# EAGLE design interrupter-reva (EAGLE 9.6.2)
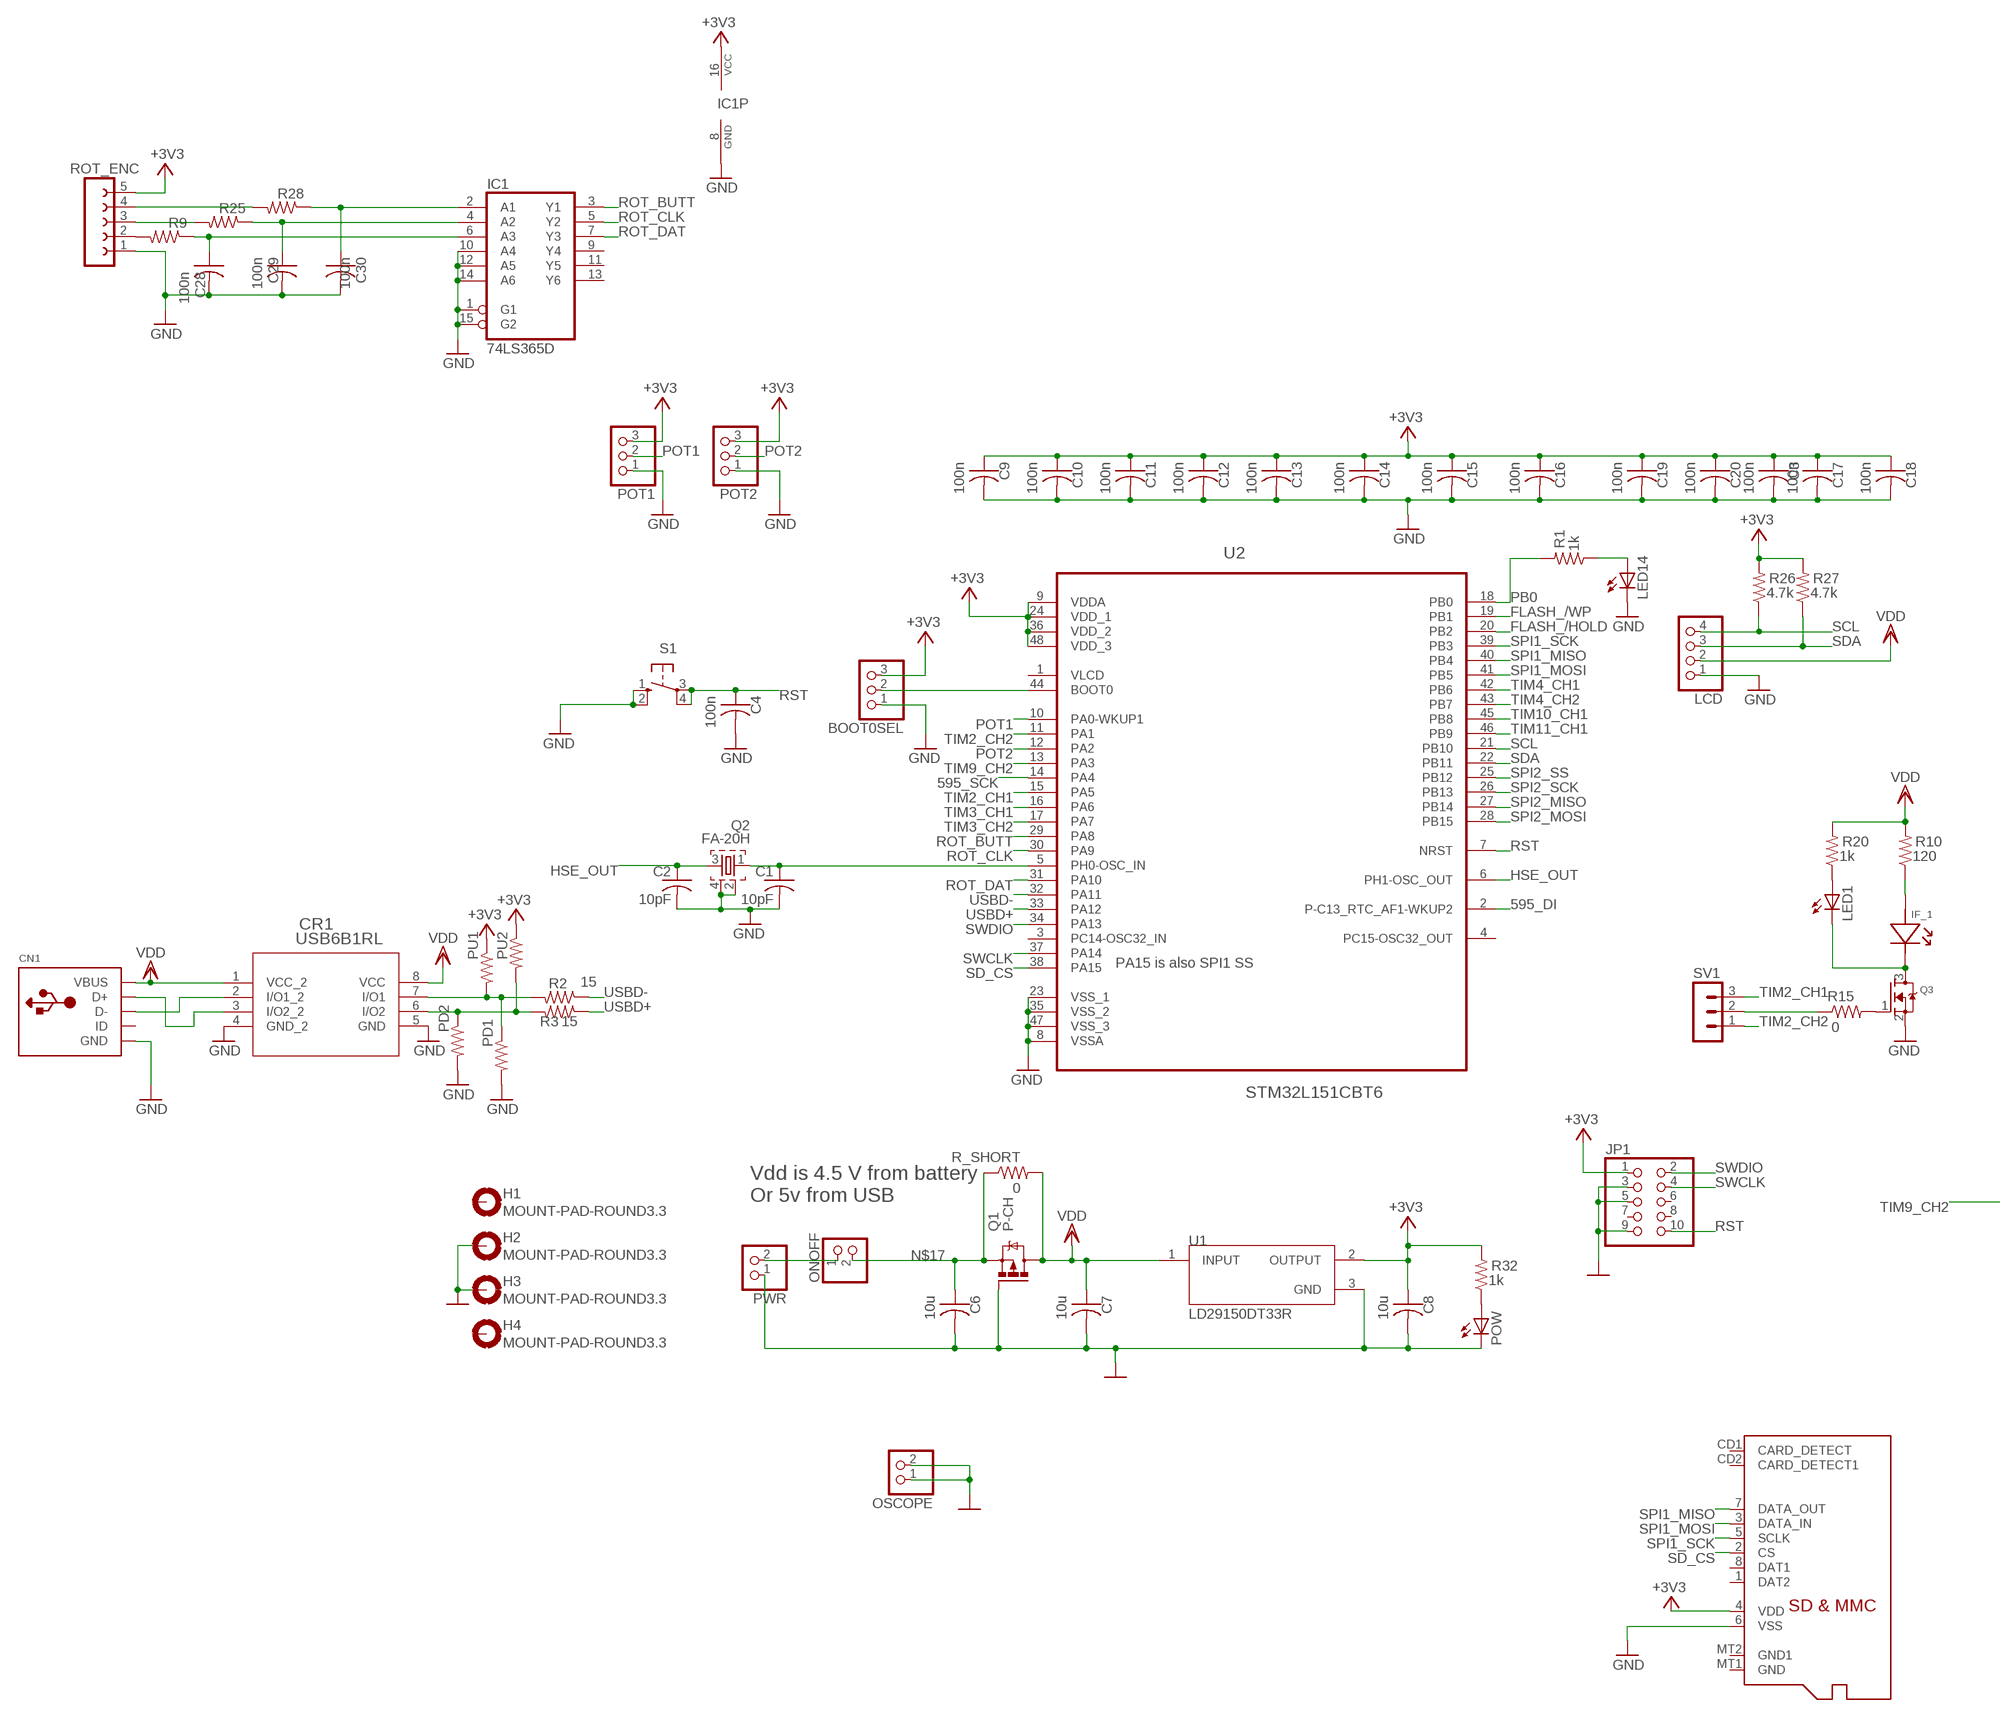
[diagram p0: schematic, sheet 1, part 1 of 2]
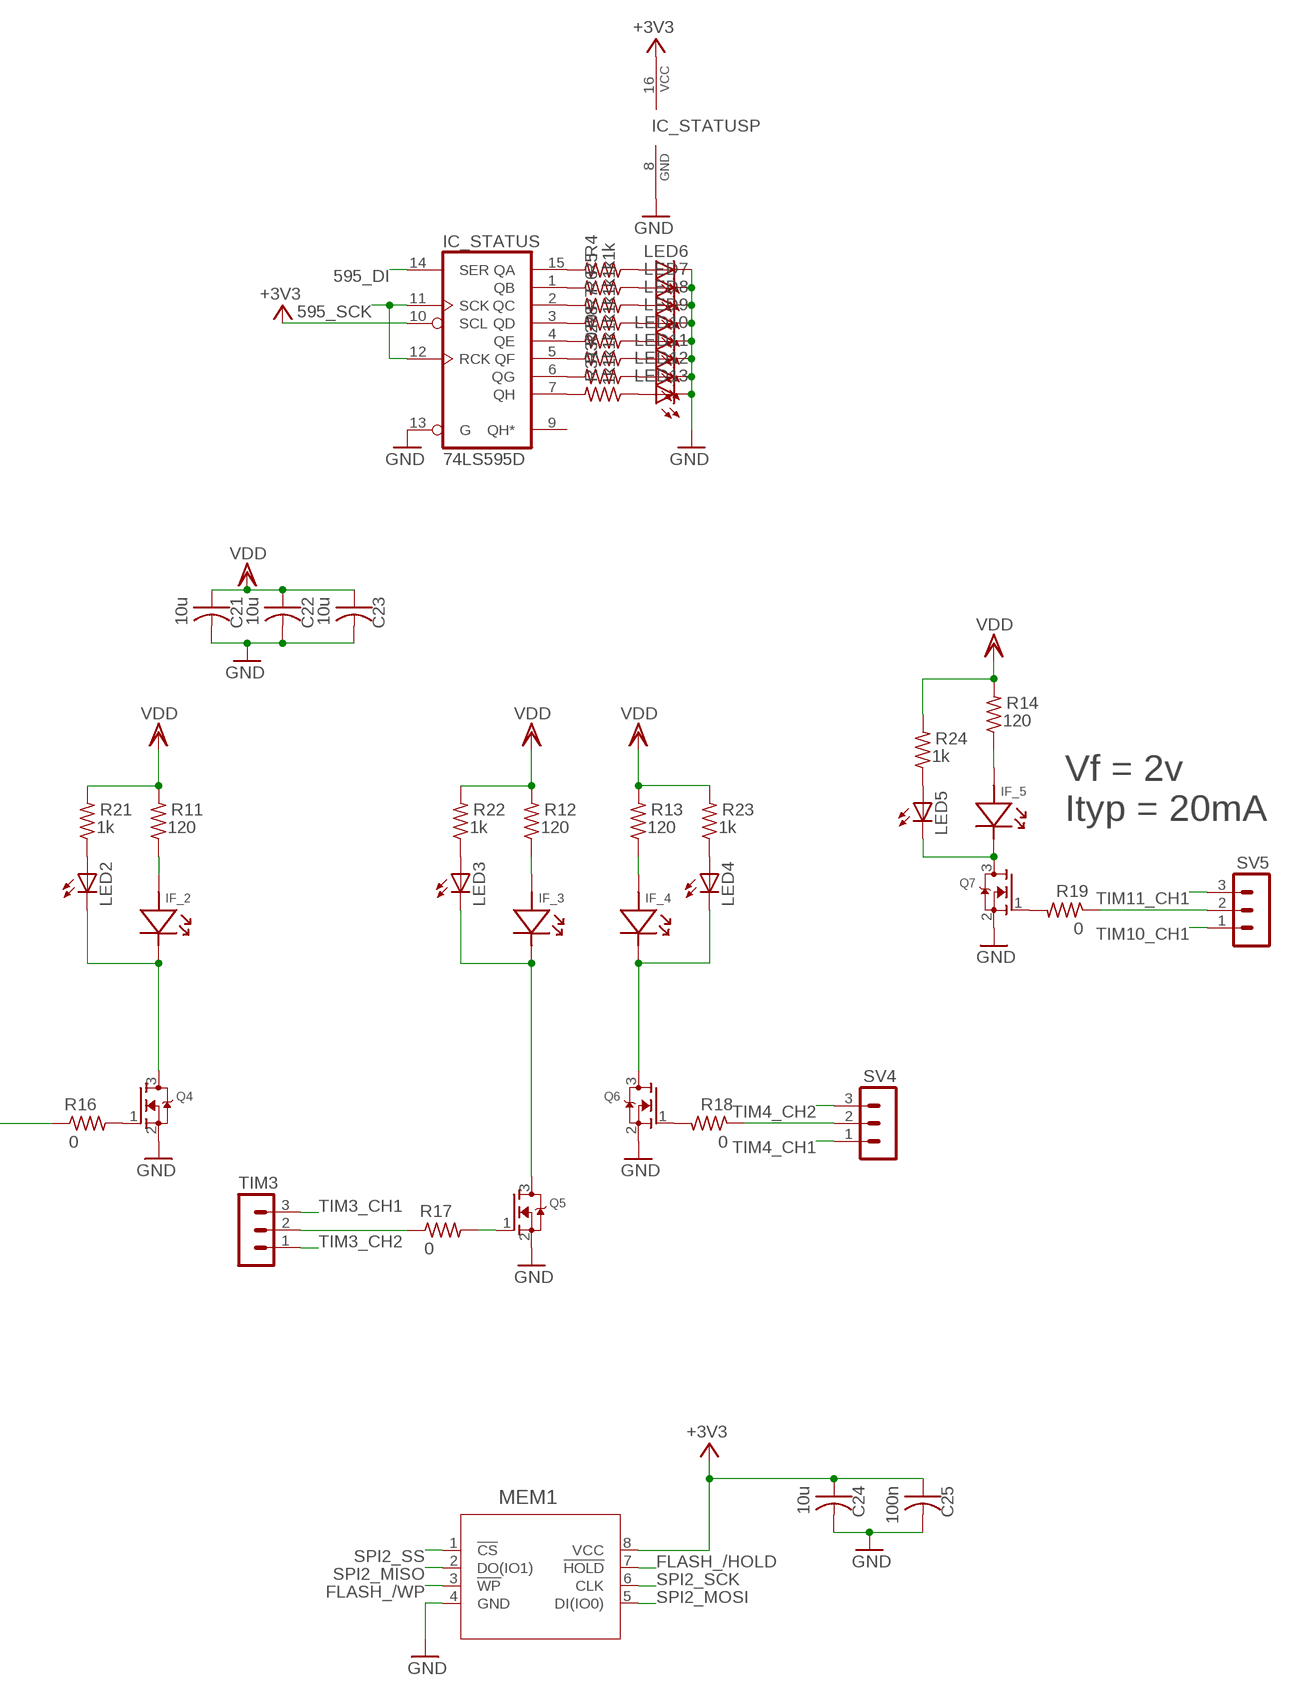
[diagram p1: schematic, sheet 1, part 2 of 2]

## Parts
BOOT0SEL  PINHD-1X3  [1X03]
C1  10pF  C-USC0603  [C0603]
C2  10pF  C-USC0603  [C0603]
C3  100n  C-USC0805  [C0805]
C4  100n  C-USC0402  [C0402]
C6  10u  C-USC0805  [C0805]
C7  10u  C-USC0805  [C0805]
C8  10u  C-USC0603  [C0603]
C9  100n  C-USC0805  [C0805]
C10  100n  C-USC0603  [C0603]
C11  100n  C-USC0805  [C0805]
C12  100n  C-USC0603  [C0603]
C13  100n  C-USC0805  [C0805]
C14  100n  C-USC0603  [C0603]
C15  100n  C-USC0805  [C0805]
C16  100n  C-USC0603  [C0603]
C17  100n  C-USC0805  [C0805]
C18  100n  C-USC0603  [C0603]
C19  100n  C-USC0603  [C0603]
C20  100n  C-USC0805  [C0805]
C21  10u  C-USC0805  [C0805]
C22  10u  C-USC0805  [C0805]
C23  10u  C-USC0805  [C0805]
C24  10u  C-USC0603  [C0603]
C25  100n  C-USC0805  [C0805]
C28  100n  C-USC0603  [C0603]
C29  100n  C-USC0603  [C0603]
C30  100n  C-USC0603  [C0603]
CN1  USBMINIB  [USB-MINIB]
CR1  USB6B1RL  [SO-8_STM]
H1  MOUNT-PAD-ROUND3.3  [3,3-PAD]
H2  MOUNT-PAD-ROUND3.3  [3,3-PAD]
H3  MOUNT-PAD-ROUND3.3  [3,3-PAD]
H4  MOUNT-PAD-ROUND3.3  [3,3-PAD]
IC1  74LS365D  [SO16]
IC_STATUS  74LS595D  [SO16]
IF_1  IF-E96E  [IF-E96E]
IF_2  IF-E96E  [IF-E96E]
IF_3  IF-E96E  [IF-E96E]
IF_4  IF-E96E  [IF-E96E]
IF_5  IF-E96E  [IF-E96E]
JP1  PINHD-2X5  [2X05]
LCD  PINHD-1X4  [1X04]
LED1  LEDCHIP-LED0805  [CHIP-LED0805]
LED2  LEDCHIP-LED0805  [CHIP-LED0805]
LED3  LEDCHIP-LED0805  [CHIP-LED0805]
LED4  LEDCHIP-LED0805  [CHIP-LED0805]
LED5  LEDCHIP-LED0805  [CHIP-LED0805]
LED6  LEDCHIP-LED0805  [CHIP-LED0805]
LED7  LEDCHIP-LED0805  [CHIP-LED0805]
LED8  LEDCHIP-LED0805  [CHIP-LED0805]
LED9  LEDCHIP-LED0805  [CHIP-LED0805]
LED10  LEDCHIP-LED0805  [CHIP-LED0805]
LED11  LEDCHIP-LED0805  [CHIP-LED0805]
LED12  LEDCHIP-LED0805  [CHIP-LED0805]
LED13  LEDCHIP-LED0805  [CHIP-LED0805]
LED14  LEDCHIP-LED0805  [CHIP-LED0805]
MEM1  W25X40CLSNIG  [WIN_SN-8_WIN]
ONOFF  PINHD-1X2  [1X02]
OSCOPE  PINHD-1X2  [1X02]
PD1  15  R-US_R0603  [R0603]
PD2  15  R-US_R0603  [R0603]
POT1  PINHD-1X3  [1X03]
POT2  PINHD-1X3  [1X03]
POW  LEDCHIP-LED0805  [CHIP-LED0805]
PU1  15  R-US_R0603  [R0603]
PU2  15  R-US_R0603  [R0603]
PWR  PINHD-1X2  [1X02]
Q1  P-CH  IRLML5203  [MICRO3]
Q2  FA-20H  [FA-20H]
Q3  MOSFET-NREFLOW  [SOT23]
Q4  MOSFET-NREFLOW  [SOT23]
Q5  MOSFET-NREFLOW  [SOT23]
Q6  MOSFET-NREFLOW  [SOT23]
Q7  MOSFET-NREFLOW  [SOT23]
R1  1k  R-US_R0603  [R0603]
R2  15  R-US_R0603  [R0603]
R3  15  R-US_R0603  [R0603]
R4  1k  R-US_R0603  [R0603]
R5  1k  R-US_R0603  [R0603]
R6  1k  R-US_R0603  [R0603]
R7  1k  R-US_R0603  [R0603]
R8  1k  R-US_R0603  [R0603]
R9  R-US_R0603  [R0603]
R10  120  R-US_R0805  [R0805]
R11  120  R-US_R0805  [R0805]
R12  120  R-US_R0805  [R0805]
R13  120  R-US_R0805  [R0805]
R14  120  R-US_R0805  [R0805]
R15  0  R-US_R0805  [R0805]
R16  0  R-US_R0805  [R0805]
R17  0  R-US_R0805  [R0805]
R18  0  R-US_R0805  [R0805]
R19  0  R-US_R0805  [R0805]
R20  1k  R-US_R0805  [R0805]
R21  1k  R-US_R0805  [R0805]
R22  1k  R-US_R0805  [R0805]
R23  1k  R-US_R0805  [R0805]
R24  1k  R-US_R0805  [R0805]
R25  R-US_R0603  [R0603]
R26  4.7k  R-US_R0805  [R0805]
R27  4.7k  R-US_R0805  [R0805]
R28  R-US_R0603  [R0603]
R29  1k  R-US_R0603  [R0603]
R30  1k  R-US_R0603  [R0603]
R31  1k  R-US_R0603  [R0603]
R32  1k  R-US_R0603  [R0603]
R_SHORT  0  R-US_R0805  [R0805]
ROT_ENC  FE05-1  [FE05-1]
S1  10-XX  [B3F-10XX]
SV1  MA03-1  [MA03-1]
SV4  MA03-1  [MA03-1]
SV5  MA03-1  [MA03-1]
TIM3  MA03-1  [MA03-1]
U1  LD29150DT33R  [DPAK456P972X240-3N]
U2  STM32L151CBT6  [QFP50P900X900X160-48N]
U$1  MICROSD  [MICROSD]

## Nets
595_DI: IC_STATUS.14(SER) U2.2(P-C13_RTC_AF1-WKUP2)
595_SCK: IC_STATUS.11(SCK) IC_STATUS.12(RCK) U2.14(PA4)
+3V3: BOOT0SEL.3 C3.1 C8.1 C9.1 C10.1 C11.1 C12.1 C13.1 C14.1 C15.1 C16.1 C17.1 C18.1 C19.1 C20.1 C24.1 C25.1 IC1.16(VCC) IC_STATUS.10(SCL) IC_STATUS.16(VCC) JP1.1 MEM1.8(VCC) POT1.3 POT2.3 PU1.1 PU2.1 R26.2 R27.2 R32.2 ROT_ENC.5 U1.2(OUTPUT) U2.9(VDDA) U2.24(VDD_1) U2.36(VDD_2) U2.48(VDD_3) U$1.4(VDD)
FLASH_/HOLD: MEM1.7(!HOLD) U2.20(PB2)
FLASH_/WP: MEM1.3(!WP) U2.19(PB1)
GND: BOOT0SEL.1 C1.2 C2.2 C3.2 C4.2 C6.2 C7.2 C8.2 C9.2 C10.2 C11.2 C12.2 C13.2 C14.2 C15.2 C16.2 C17.2 C18.2 C19.2 C20.2 C21.2 C22.2 C23.2 C24.2 C25.2 C28.2 C29.2 C30.2 CN1.GND CR1.4(GND_2) CR1.5(GND) H2.B3,3(MOUNT) H3.B3,3(MOUNT) IC1.1(G1) IC1.8(GND) IC1.10(A4) IC1.12(A5) IC1.14(A6) IC1.15(G2) IC_STATUS.8(GND) IC_STATUS.13(G) JP1.3 JP1.5 JP1.9 LCD.1 LED6.C LED7.C LED8.C LED9.C LED10.C LED11.C LED12.C LED13.C LED14.C MEM1.4(GND) OSCOPE.1 OSCOPE.2 PD1.2 PD2.2 POT1.1 POT2.1 POW.C PWR.1 Q1.1(G) Q2.2 Q2.4 Q3.2(S) Q4.2(S) Q5.2(S) Q6.2(S) Q7.2(S) ROT_ENC.1 S1.1(S) S1.2(S1) U1.3(GND) U2.8(VSSA) U2.23(VSS_1) U2.35(VSS_2) U2.47(VSS_3) U$1.6(VSS)
HSE_OUT: C2.1 Q2.3 U2.6(PH1-OSC_OUT)
N$1: R9.2 ROT_ENC.2
N$2: LED1.A R20.1
N$3: CN1.D- CR1.2(I/O1_2)
N$4: LED2.A R21.1
N$5: LED3.A R22.1
N$6: LED5.A R24.1
N$7: IF_1.ANODE R10.1
N$8: IF_2.ANODE R11.1
N$9: IF_3.ANODE R12.1
N$10: IF_4.ANODE R13.1
N$11: IF_5.ANODE R14.1
N$12: IF_1.CATHODE LED1.C Q3.3(D)
N$13: IF_2.CATHODE LED2.C Q4.3(D)
N$14: IF_3.CATHODE LED3.C Q5.3(D)
N$15: IF_4.CATHODE LED4.C Q6.3(D)
N$16: IF_5.CATHODE LED5.C Q7.3(D)
N$17: C6.1 ONOFF.2 Q1.2(S) R_SHORT.1
N$18: ONOFF.1 PWR.2
N$19: CN1.D+ CR1.3(I/O2_2)
N$20: CR1.7(I/O1) PD1.1 PU1.2 R2.2
N$21: R25.2 ROT_ENC.3
N$22: Q7.1(G) R19.2
N$23: R28.2 ROT_ENC.4
N$24: CR1.6(I/O2) PD2.1 PU2.2 R3.2
N$25: LED4.A R23.1
N$26: C28.1 IC1.6(A3) R9.1
N$27: C29.1 IC1.4(A2) R25.1
N$28: C30.1 IC1.2(A1) R28.1
N$29: LED6.A R4.1
N$30: IC_STATUS.15(QA) R4.2
N$31: C1.1 Q2.1 U2.5(PH0-OSC_IN)
N$32: LED7.A R5.1
N$33: IC_STATUS.1(QB) R5.2
N$34: LED8.A R6.1
N$35: IC_STATUS.2(QC) R6.2
N$36: LED9.A R7.1
N$37: IC_STATUS.3(QD) R7.2
N$38: LED10.A R8.1
N$39: IC_STATUS.4(QE) R8.2
N$40: LED11.A R29.1
N$41: IC_STATUS.5(QF) R29.2
N$42: LED12.A R30.1
N$43: IC_STATUS.6(QG) R30.2
N$44: BOOT0SEL.2 U2.44(BOOT0)
N$45: R15.1 SV1.2
N$46: Q3.1(G) R15.2
N$47: Q4.1(G) R16.2
N$48: LED13.A R31.1
N$49: Q5.1(G) R17.2
N$50: R17.1 TIM3.2
N$51: Q6.1(G) R18.2
N$52: R18.1 SV4.2
N$53: R19.1 SV5.2
N$54: IC_STATUS.7(QH) R31.2
N$55: LED14.A R1.1
N$56: POW.A R32.1
PB0: R1.2 U2.18(PB0)
POT1: POT1.2 U2.10(PA0-WKUP1)
POT2: POT2.2 U2.12(PA2)
ROT_BUTT: IC1.3(Y1) U2.29(PA8)
ROT_CLK: IC1.5(Y2) U2.30(PA9)
ROT_DAT: IC1.7(Y3) U2.31(PA10)
RST: C4.1 JP1.10 S1.3(P) S1.4(P1) U2.7(NRST)
SCL: LCD.4 R26.1 U2.21(PB10)
SD_CS: U2.38(PA15) U$1.2(CS)
SDA: LCD.3 R27.1 U2.22(PB11)
SPI1_MISO: U2.40(PB4) U$1.7(DATA_OUT)
SPI1_MOSI: U2.41(PB5) U$1.3(DATA_IN)
SPI1_SCK: U2.39(PB3) U$1.5(SCLK)
SPI2_MISO: MEM1.2(DO(IO1)) U2.27(PB14)
SPI2_MOSI: MEM1.5(DI(IO0)) U2.28(PB15)
SPI2_SCK: MEM1.6(CLK) U2.26(PB13)
SPI2_SS: MEM1.1(!CS) U2.25(PB12)
SWCLK: JP1.4 U2.37(PA14)
SWDIO: JP1.2 U2.34(PA13)
TIM2_CH1: SV1.3 U2.15(PA5)
TIM2_CH2: SV1.1 U2.11(PA1)
TIM3_CH1: TIM3.3 U2.16(PA6)
TIM3_CH2: TIM3.1 U2.17(PA7)
TIM4_CH1: SV4.1 U2.42(PB6)
TIM4_CH2: SV4.3 U2.43(PB7)
TIM9_CH2: R16.1 U2.13(PA3)
TIM10_CH1: SV5.1 U2.45(PB8)
TIM11_CH1: SV5.3 U2.46(PB9)
USBD+: R3.1 U2.33(PA12)
USBD-: R2.1 U2.32(PA11)
VDD: C7.1 C21.1 C22.1 C23.1 CN1.VBUS CR1.1(VCC_2) CR1.8(VCC) LCD.2 Q1.3(D) R10.2 R11.2 R12.2 R13.2 R14.2 R20.2 R21.2 R22.2 R23.2 R24.2 R_SHORT.2 U1.1(INPUT)
Unconnected: CN1.ID H1.B3,3(MOUNT) H4.B3,3(MOUNT) IC1.9(Y4) IC1.11(Y5) IC1.13(Y6) IC_STATUS.9(QH*) JP1.6 JP1.7 JP1.8 U2.3(PC14-OSC32_IN) U2.4(PC15-OSC32_OUT) U$1.1(DAT2) U$1.8(DAT1) U$1.CD1(CARD_DETECT) U$1.CD2(CARD_DETECT1) U$1.MT1(GND) U$1.MT2(GND1)

## Notes on the sheet
- Vf = 2v
  Ityp = 20mA
- PA15 is also SPI1 SS
- Vdd is 4.5 V from battery
  Or 5v from USB

## Power pins joined to a net without a drawn wire
VLCD: U2.1(VLCD)

## Library data of the parts
BOOT0SEL POT1 POT2 = pinhead:PINHD-1X3: PIN HEADER
C1-C4 C6-C25 C28-C30 = rcl:C-US: CAPACITOR, American symbol; SPICEPREFIX: C
CN1 = adafruit:USB: USB Connectors USBMINIB - Surface Mount Female Mini-B USB Connector 4UConnector: 06564 By microbuilder.eu Thru-hole RA Female Mini-B USB Connector 4UConnector: 18732 By ladyada.net
CR1 = USB_ESD:USB6B1RL; COPYRIGHT: Copyright (C) 2022 Ultra Librarian. All rights reserved.; DIGI-KEY_PART_NUMBER_1: 497-3281-1-ND; DIGI-KEY_PART_NUMBER_2: 497-3281-2-ND; DIGI-KEY_PART_NUMBER_3: 497-3281-6-ND; MANUFACTURER_PART_NUMBER: USB6B1RL; MFR_NAME: STMicroelectronics
H1-H4 = holes:MOUNT-PAD-ROUND: MOUNTING PAD, round
IC1 = 74xx-us:74*365: Hex BUS DRIVER, 3-state
IC_STATUS = 74xx-us:74*595: 8-bit SHIFT REGISTER, output latch
IF_1-IF_5 = IF-E96E:IF-E96E
JP1 = pinhead:PINHD-2X5: PIN HEADER
LCD = pinhead:PINHD-1X4: PIN HEADER
LED1-LED14 POW = adafruit:LED: LED OSRAM: - CHIPLED LG R971, LG N971, LY N971, LG Q971, LY Q971, LO R971, LY R971 LH N974, LH R974 LS Q976, LO Q976, LY Q976 LO Q996 - Hyper CHIPLED LW Q18S LB Q993, LB Q99A, LB R99A - SideLED LS A670, LO A670, LY A670, LG A670, LP A670 LB A673, LV A673, LT A673, LW A673 LH A674 LY A675 LS A676, LA A676, LO A676, LY A676, LW A676 LS A679, LY A679, LG A679 - Hyper Micro SIDELED® LS Y876, LA Y876, LO Y876, LY Y876 LT Y87S - SmartLED LW L88C, LW L88S LB L89C, LB L89S, LG L890 LS L89K, LO L89K, LY L89K LS L896, LA L896, LO L896, LY L896 - TOPLED LS T670, LO T670, LY T670, LG T670, LP T670 LSG T670, LSP T670, LSY T670, LOP T670, LYG T670 LG T671, LOG T671, LSG T671 LB T673, LV T673, LT T673, LW T673 LH T674 LS T676, LA T676, LO T676, LY T676, LB T676, LH T676, LSB T676, LW T676 LB T67C, LV T67C, LT T67C, LS T67K, LO T67K, LY T67K, LW E67C LS E67B, LA E67B, LO E67B, LY E67B, LB E67C, LV E67C, LT E67C LW T67C LS T679, LY T679, LG T679 LS T770, LO T770, LY T770, LG T770, LP T770 LB T773, LV T773, LT T773, LW T773 LH T774 LS E675, LA E675, LY E675, LS T675 LS T776, LA T776, LO T776, LY T776, LB T776 LHGB T686 LT T68C, LB T68C - Hyper Mini TOPLED® LB M676 - Mini TOPLED Santana® LG M470 LS M47K, LO M47K, LY M47K Source: http://www.osram.convergy.de/
MEM1 = W25X40CL:W25X40CLSNIG; COPYRIGHT: Copyright (C) 2022 Ultra Librarian. All rights reserved.; DIGI-KEY_PART_NUMBER_1: W25X40CLSNIG-CRL-ND; DIGI-KEY_PART_NUMBER_2: W25X40CLSNIG-ND; DIGI-KEY_PART_NUMBER_3: WICC-1015-ND; DIGI-KEY_PART_NUMBER_4: WICC-1023-ND; DIGI-KEY_PART_NUMBER_5: WICC-1025-ND; DIGI-KEY_PART_NUMBER_6: WICC-1026-ND; MANUFACTURER_PART_NUMBER: W25X40CLSNIG; MFR_NAME: Winbond
ONOFF OSCOPE PWR = pinhead:PINHD-1X2: PIN HEADER
PD1 PD2 PU1 PU2 R1-R32 R_SHORT = rcl:R-US_: RESISTOR, American symbol; SPICEPREFIX: R
Q1 = transistor-power:IRLML5203: HEXFET P-Channel Power MOSFET
Q2 = crystal:FA-: MHz RANGE CRYSTAL UNIT Source: Epson Toyocom
Q3-Q7 = adafruit:MOSFET-N: N-Channel Mosfet 2N7002E - 60V 260mA SOT23 [Digikey: 2N7002ET1GOSTR-ND] - REEL BSH103 - 30V 850mA SOT23 [Digikey: 568-5013-1-ND]
ROT_ENC = con-lsta:FE05-1: FEMALE HEADER; OC_FARNELL: unknown; OC_NEWARK: unknown
S1 = switch-omron:10-XX: OMRON SWITCH; MPN: B3F-1000; OC_FARNELL: 176432; OC_NEWARK: 36M3542
SV1 SV4 SV5 TIM3 = con-lstb:MA03-1: PIN HEADER; OC_FARNELL: unknown; OC_NEWARK: unknown
U1 = LD29150DT33R:LD29150DT33R: LD29150 Series 1.5 A 3.3 V Fixed Output SMT LDO Voltage Regulator - TO-252 Check availability <https://pricing.snapeda.com/parts/LD29150DT33R/STMicroelectronics/view-part?ref=eda>; AVAILABILITY: In Stock; DESCRIPTION: Linear Voltage Regulator IC Positive Fixed 1 Output 1.5A DPAK; MF: STMicroelectronics; MP: LD29150DT33R; PACKAGE: TO-252 STMicroelectronics; PRICE: None; PURCHASE-URL: https://pricing.snapeda.com/search/part/LD29150DT33R/?ref=eda
U2 = STM32L151CBT6:STM32L151CBT6: ARM-based 32-bit MCU Check availability <https://pricing.snapeda.com/parts/STM32L151CBT6/STMicroelectronics/view-part?ref=eda>; AVAILABILITY: In Stock; DESCRIPTION: ARM® Cortex®-M3 series Microcontroller IC 32-Bit Single-Core 32MHz 128KB (128K x 8) FLASH 48-LQFP (7x7); MF: STMicroelectronics; MP: STM32L151CBT6; PACKAGE: LQFP-48 STMicroelectronics; PRICE: None; PURCHASE-URL: https://pricing.snapeda.com/search/part/STM32L151CBT6/?ref=eda
U$1 = adafruit:MICROSD: Micro-SD / Transflash card holder with SPI pinout For the 3M # 2908-05WB-MG and/or 4UCON #19656 push-push type

## Board
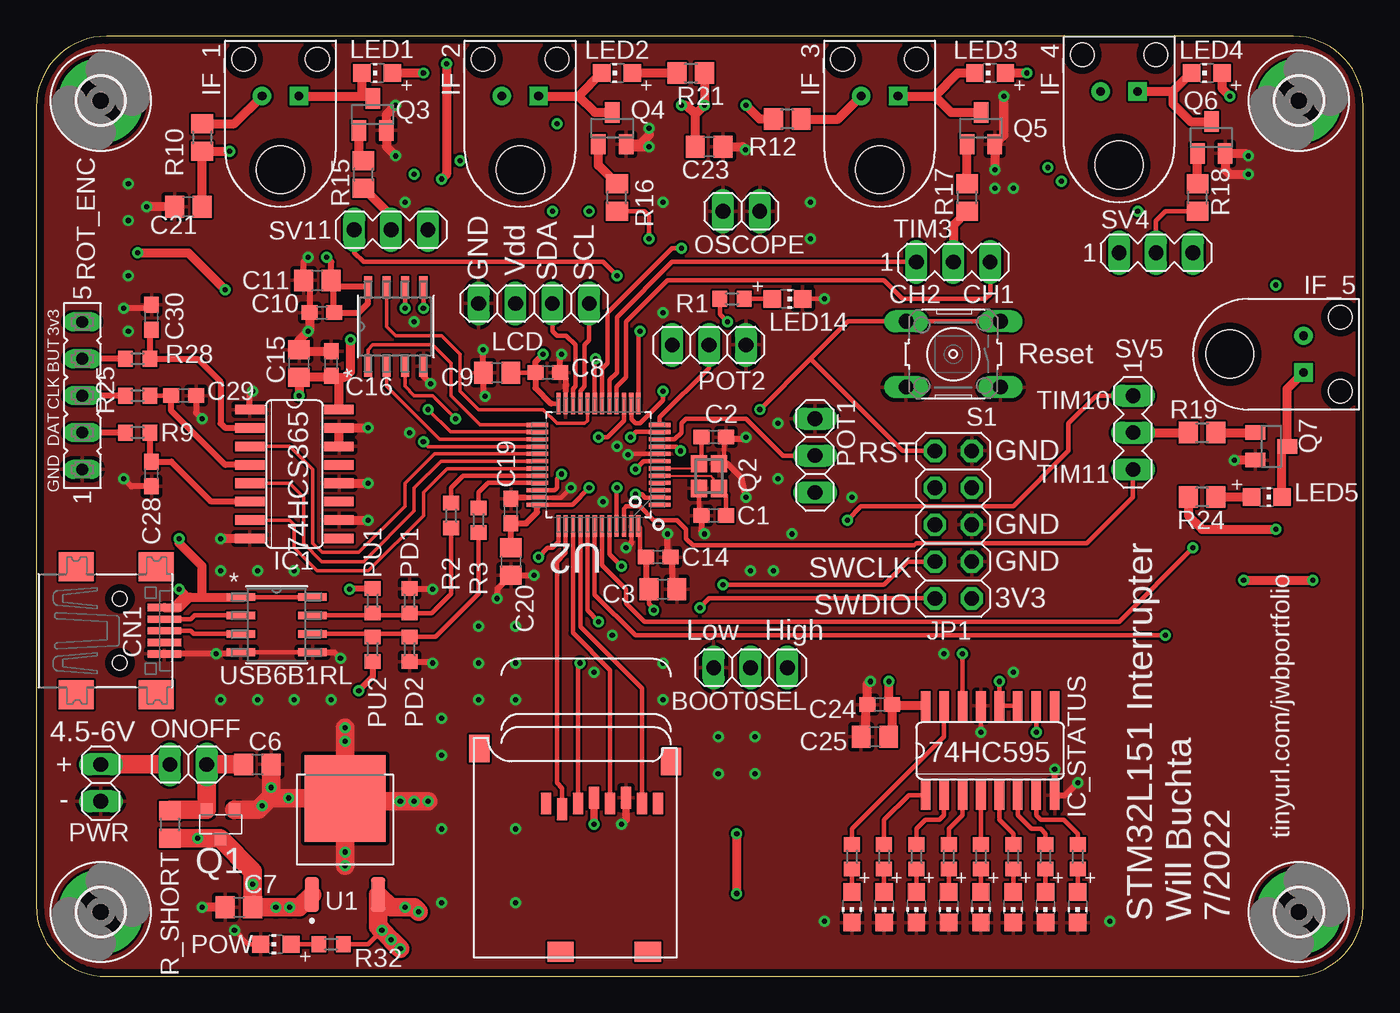
[diagram p2: board, top side]
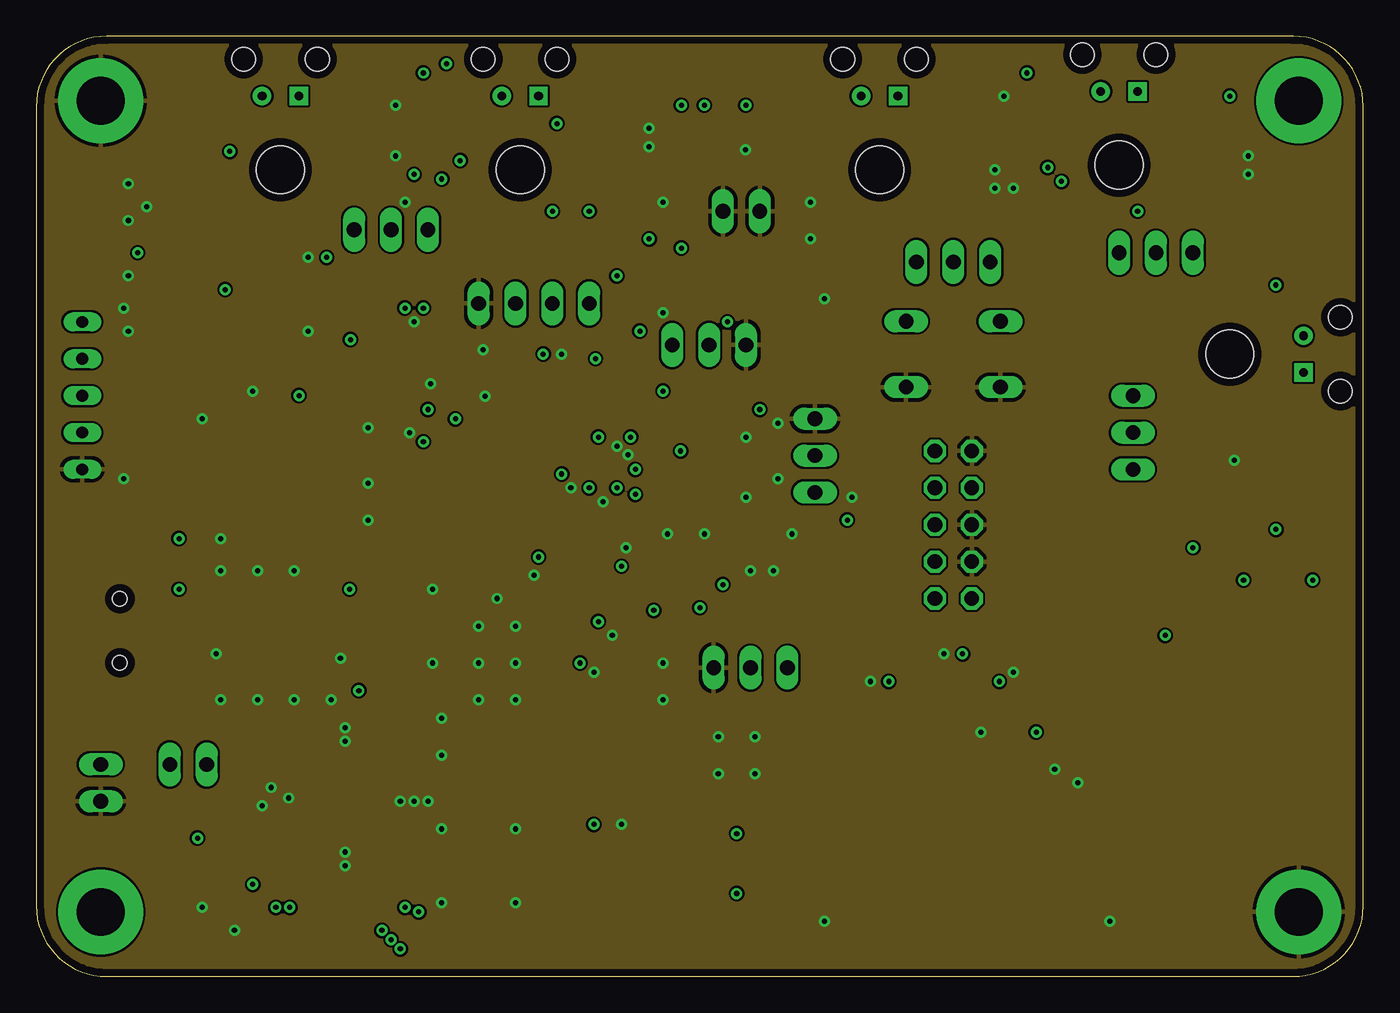
[diagram p3: board, inner layer Route2]
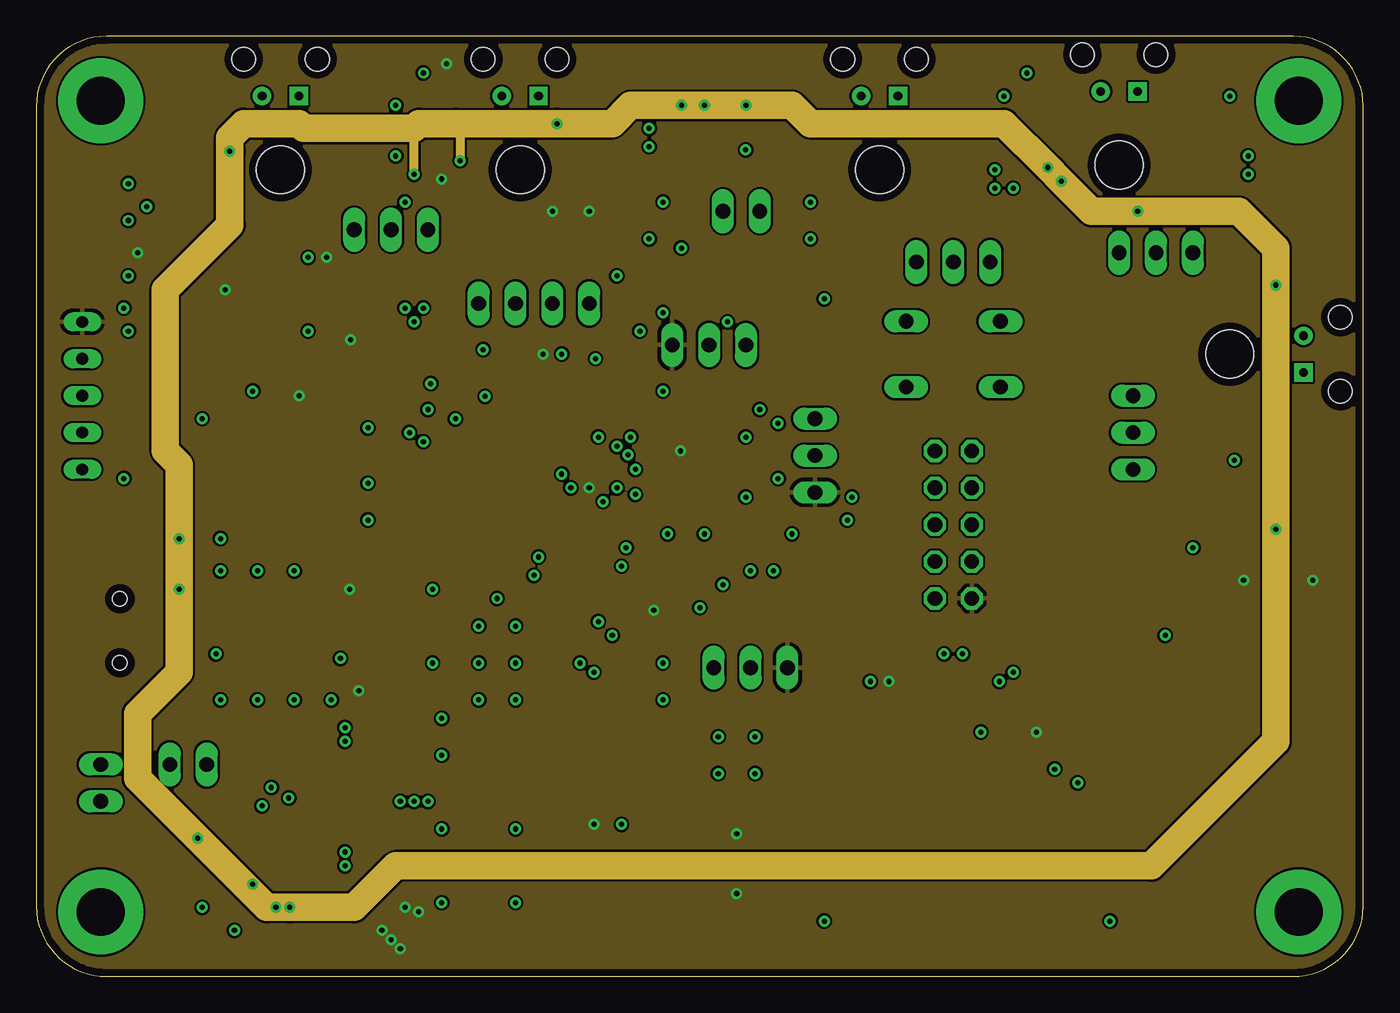
[diagram p4: board, inner layer Route15]
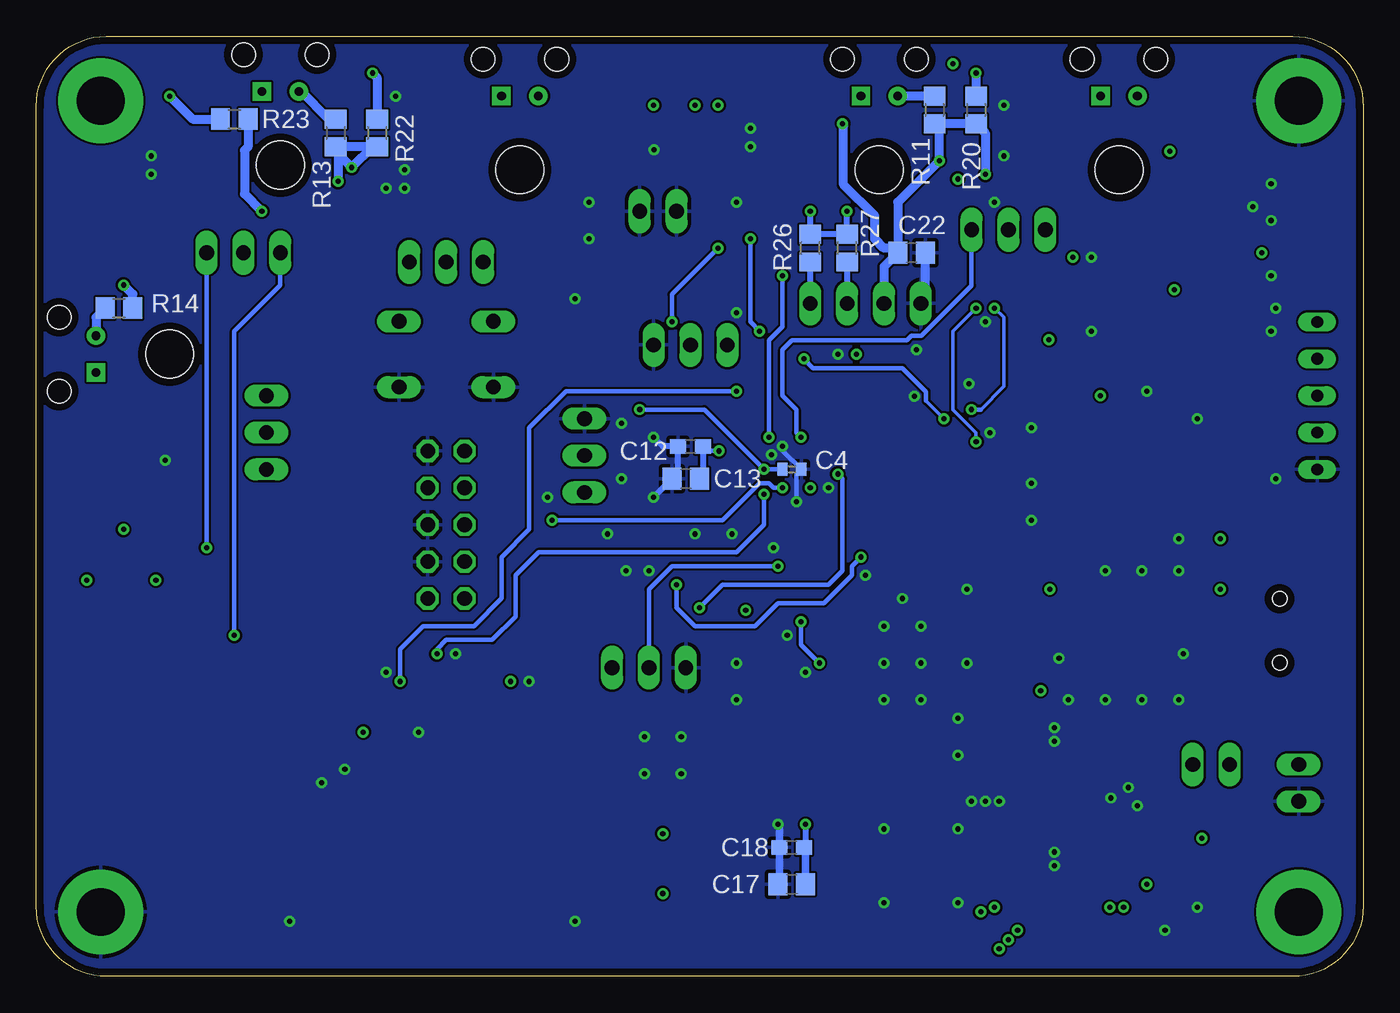
[diagram p5: board, bottom side, seen from below]

Size 91.43 x 64.76 mm. Coordinates in mm from the lower left corner, seen from the top.
Outline: 0,59.91 0,4.87 arc90 4.87,0 86.58,0 arc90 91.43,4.84 91.43,59.94 arc90 86.61,64.76 4.84,64.76 arc90 0,59.91
Copper layers (1+2*15+16): Top 0.035mm / dielectric 0.2mm / Route2 0.035mm / dielectric 1.5mm / Route15 0.035mm / dielectric 0.2mm / Bottom 0.035mm
Design rules "default *": minimum track width 6mil, minimum drill 0.35mm, track to track 6mil, track to pad 6mil, pad to pad 6mil, via to via 8mil, smd to smd 6mil, copper to edge 20mil, drill to drill 6mil, minimum pad ring 10mil, minimum via ring 8mil, stop-mask expansion 4mil, vias tented up to drill 0mil, thermal gap 10mil

### Footprints (pad centres in the part's own frame; a part is rotated, then mirrored left to right if it is on the bottom)
1X03 = drill 1.016 long: 1 -2.54,0; 2 0,0; 3 2.54,0
C0603 = smd 1.1 x 1: 1 -0.85,0; 2 0.85,0
C0805 = smd 1.3 x 1.5: 1 -0.95,0; 2 0.95,0
C0402 = smd 0.7 x 0.9: 1 -0.65,0; 2 0.65,0
USB-MINIB = smd 0.5 x 2.308: D+ 0,4.064; D- -0.8,4.064; GND 1.6,4.064; ID 0.8,4.064; VBUS -1.6,4.064 | smd 2 x 2.4: GND1 -4.4,-2; GND2 -4.4,3.5; GND3 4.4,3.5; GND4 4.4,-2 | hole 1: -2.2,1; 2.2,1
SO-8_STM = smd 1.981 x 0.533: 1 -2.464,1.905; 2 -2.464,0.635; 3 -2.464,-0.635; 4 -2.464,-1.905; 5 2.464,-1.905; 6 2.464,-0.635; 7 2.464,0.635; 8 2.464,1.905
3,3-PAD = drill 3.3 pad 5.842: B3,3 0,0
SO16 = smd 0.66 x 2.032: 1 -4.445,-3.073; 2 -3.175,-3.073; 3 -1.905,-3.073; 4 -0.635,-3.073; 5 0.635,-3.073; 6 1.905,-3.073; 7 3.175,-3.073; 8 4.445,-3.073; 9 4.445,3.073; 10 3.175,3.073; 11 1.905,3.073; 12 0.635,3.073; 13 -0.635,3.073; 14 -1.905,3.073; 15 -3.175,3.073; 16 -4.445,3.073
IF-E96E = drill 0.6 pad 1.27: ANODE 0,0 | drill 0.6 pad 1.27 square: CATHODE 2.54,0 | hole 1.626: -1.27,2.54; 3.81,2.54 | hole 3.302: 1.27,-5.08
2X05 = drill 1.016 octagon: 1 -5.08,-1.27; 2 -5.08,1.27; 3 -2.54,-1.27; 4 -2.54,1.27; 5 0,-1.27; 6 0,1.27; 7 2.54,-1.27; 8 2.54,1.27; 9 5.08,-1.27; 10 5.08,1.27
1X04 = drill 1.016 long: 1 -3.81,0; 2 -1.27,0; 3 1.27,0; 4 3.81,0
CHIP-LED0805 = smd 1.2 x 1.2: A 0,-1.05; C 0,1.05
WIN_SN-8_WIN = smd 1.46 x 0.559: 1 -2.724,1.905; 2 -2.724,0.635; 3 -2.724,-0.635; 4 -2.724,-1.905; 5 2.724,-1.905; 6 2.724,-0.635; 7 2.724,0.635; 8 2.724,1.905
1X02 = drill 1.016 long: 1 -1.27,0; 2 1.27,0
R0603 = smd 1 x 1.1: 1 -0.85,0; 2 0.85,0
MICRO3 = smd 0.8 x 0.9: 1 -0.95,-1; 2 0.95,-1; 3 0,1
FA-20H = smd 1.2 x 1.1: 1 -0.85,-0.7; 2 0.85,-0.7; 3 0.85,0.7; 4 -0.85,0.7
SOT23 = smd 1 x 1.4: 1 -0.95,-1.1; 2 0.95,-1.1; 3 0,1.1
R0805 = smd 1.3 x 1.5: 1 -0.95,0; 2 0.95,0
FE05-1 = drill 0.813 long: 1 -5.08,0; 2 -2.54,0; 3 0,0; 4 2.54,0; 5 5.08,0
B3F-10XX = drill 1.016 long: 1 -3.251,2.261; 2 3.251,2.261; 3 -3.251,-2.261; 4 3.251,-2.261
MA03-1 = drill 1.016 long: 1 -2.54,0; 2 0,0; 3 2.54,0
DPAK456P972X240-3N = smd 2.4 x 0.98: 1 -4.2,2.28; 2 -4.2,-2.28 | smd 5.96 x 5.57: 3 2.42,0
QFP50P900X900X160-48N = smd 1.473 x 0.279: 1 -4.216,2.743; 2 -4.216,2.261; 3 -4.216,1.753; 4 -4.216,1.245; 5 -4.216,0.762; 6 -4.216,0.254; 7 -4.216,-0.254; 8 -4.216,-0.762; 9 -4.216,-1.245; 10 -4.216,-1.753; 11 -4.216,-2.261; 12 -4.216,-2.743; 25 4.216,-2.743; 26 4.216,-2.261; 27 4.216,-1.753; 28 4.216,-1.245; 29 4.216,-0.762; 30 4.216,-0.254; 31 4.216,0.254; 32 4.216,0.762; 33 4.216,1.245; 34 4.216,1.753; 35 4.216,2.261; 36 4.216,2.743 | smd 0.279 x 1.473: 13 -2.743,-4.216; 14 -2.261,-4.216; 15 -1.753,-4.216; 16 -1.245,-4.216; 17 -0.762,-4.216; 18 -0.254,-4.216; 19 0.254,-4.216; 20 0.762,-4.216; 21 1.245,-4.216; 22 1.753,-4.216; 23 2.261,-4.216; 24 2.743,-4.216; 37 2.743,4.216; 38 2.261,4.216; 39 1.753,4.216; 40 1.245,4.216; 41 0.762,4.216; 42 0.254,4.216; 43 -0.254,4.216; 44 -0.762,4.216; 45 -1.245,4.216; 46 -1.753,4.216; 47 -2.261,4.216; 48 -2.743,4.216
MICROSD = smd 0.7 x 1.5: 1 9,-10.64; 2 7.9,-10.24; 3 6.8,-10.64; 4 5.7,-11.04; 5 4.6,-10.64; 6 3.5,-11.04; 7 2.4,-10.64; 8 1.3,-10.64 | smd 1.8 x 1.4: CD1 2,-0.44; CD2 8,-0.44 | smd 1.4 x 1.9: MT1 0.4,-13.54; MT2 13.6,-14.44

### Placement (x,y rotation side)
BOOT0SEL  49.21,21.27 0 top
C1  46.67,31.75 180 top
C2  46.67,37.15 0 top
C3  43.18,26.67 0 top
C4  39.37,34.92 0 bottom
C6  15.24,14.61 0 top
C7  13.97,4.76 180 top
C8  35.24,41.59 0 top
C9  31.75,41.59 180 top
C10  19.68,45.72 180 top
C11  19.37,47.94 180 top
C12  46.35,36.51 180 bottom
C13  46.67,34.29 180 bottom
C14  42.86,28.89 0 top
C15  18.1,42.23 90 top
C16  20.32,42.23 90 top
C17  39.37,6.35 180 bottom
C18  39.37,8.89 180 bottom
C19  32.7,32.07 90 top
C20  32.7,28.57 270 top
C21  10.48,53.02 180 top
C22  31.11,49.85 0 bottom
C23  46.35,57.15 0 top
C24  58.1,18.73 180 top
C25  57.78,16.51 180 top
C28  7.94,34.61 270 top
C29  10.16,40.01 0 top
C30  7.94,45.4 90 top
CN1  4.76,23.81 270 top
CR1  16.56,24.23 0 top
H1  4.45,4.45 0 top
H2  4.45,60.33 0 top
H3  87,4.45 0 top
H4  87,60.33 0 top
IC1  17.78,34.61 270 top
IC_STATUS  65.72,15.56 0 top
IF_1  15.56,60.64 0 top
IF_2  32.07,60.64 0 top
IF_3  56.83,60.64 0 top
IF_4  73.34,60.96 0 top
IF_5  87.31,44.13 270 top
JP1  63.18,31.11 90 top
LCD  34.29,46.35 0 top
LED1  23.5,62.23 90 top
LED2  40.01,62.23 90 top
LED3  65.72,62.23 90 top
LED4  80.64,62.23 90 top
LED5  84.77,33.02 270 top
LED6  56.2,4.76 180 top
LED7  58.42,4.76 180 top
LED8  60.64,4.76 180 top
LED9  62.87,4.76 180 top
LED10  65.09,4.76 180 top
LED11  67.31,4.76 180 top
LED12  69.53,4.76 180 top
LED13  71.75,4.76 180 top
LED14  51.75,46.67 270 top
MEM1  24.77,44.77 90 top
ONOFF  10.48,14.61 0 top
OSCOPE  48.58,52.7 0 top
PD1  25.72,25.87 90 top
PD2  25.72,22.54 270 top
POT1  53.66,35.88 270 top
POT2  46.35,43.5 180 top
POW  16.51,2.22 90 top
PU1  23.18,25.87 270 top
PU2  23.18,22.54 90 top
PWR  4.45,13.34 90 top
Q1  12.7,10.48 180 top
Q2  46.35,34.47 90 top
Q3  23.18,59.37 0 top
Q4  39.69,58.42 0 top
Q5  65.09,58.42 0 top
Q6  80.96,57.78 0 top
Q7  85.09,36.51 270 top
R1  47.94,46.67 180 top
R2  28.57,31.75 270 top
R3  30.48,31.43 270 top
R4  56.2,8.26 90 top
R5  58.42,8.26 90 top
R6  60.64,8.26 90 top
R7  62.87,8.26 90 top
R8  65.09,8.26 90 top
R9  6.99,37.47 180 top
R10  11.43,57.78 270 top
R11  29.53,59.69 270 bottom
R12  51.75,59.05 180 top
R13  70.8,58.1 270 bottom
R14  85.72,46.04 0 bottom
R15  22.54,55.24 90 top
R16  40.01,53.66 90 top
R17  64.14,53.66 90 top
R18  80.01,53.66 90 top
R19  80.33,37.47 0 top
R20  26.67,59.69 270 bottom
R21  45.09,62.23 0 top
R22  67.94,58.1 270 bottom
R23  77.79,59.05 0 bottom
R24  80.33,33.02 180 top
R25  6.99,40.01 180 top
R26  38.1,50.16 90 bottom
R27  35.56,50.16 90 bottom
R28  6.99,42.55 180 top
R29  67.31,8.26 90 top
R30  69.53,8.26 90 top
R31  71.75,8.26 90 top
R32  20.32,2.22 0 top
R_SHORT  9.21,10.48 270 top
ROT_ENC  3.17,40.01 90 top
S1  63.18,42.86 180 top
SV1  24.45,51.44 0 top
SV4  77.15,49.85 0 top
SV5  75.56,37.47 270 top
TIM3  63.18,49.21 0 top
U1  21.27,9.84 90 top
U2  38.73,35.24 180 top
U$1  44.13,1.27 180 top

### Tracks (layer width: path | path; a pad name or v marks a point on that pad's centre or on a via)
595_DI  (via drill 0.35)
  Top 0.305: U2.2 41.95,32.98 41.72,33.21 v41.27,33.21 | v63.82,22.23 IC_STATUS.14
  Bottom 0.305: v41.27,33.21 41.27,31.11 43.18,29.21 56.83,29.21 58.42,27.62 58.42,24.77 60.01,23.18 63.18,23.18 63.82,22.54 v63.82,22.23
595_SCK  (via drill 0.35)
  Top 0.305: IC_STATUS.11 IC_STATUS.12 v66.36,20.32 | v43.18,40.32 43.18,39.69 41.59,38.1 41.27,38.1 41,38.38 U2.14
  Bottom 0.305: v43.18,40.32 54.93,40.32 57.47,37.78 57.47,30.8 59.37,28.89 59.37,26.04 61.28,24.13 64.77,24.13 66.36,22.54 v66.36,20.32
+3V3  (via drill 0.35)
  Top 0.305: C9.1 C8.1 | 35.47,39.46 U2.24 | 34.52,32.31 U2.36 36.94,32.5 v38.1,33.66 | U2.48 41.59,30.91 41.59,29.31 C14.1 | U2.9 44.11,36.49 v44.4,36.2 | IC_STATUS.10 v68.9,16.83 | C3.1 42.23,25.69 42.55,25.38 v42.55,25.22 | R32.2 22.86,2.22 v23.81,3.17
  Top 0.406: v34.92,42.86 34.39,42.33 C8.1 34.39,40.54 35.47,39.46 | 34.52,32.31 34.52,31.98 33.76,31.22 C19.1 C20.1 | 20.48,47.78 20.77,47.49 MEM1.8 22.86,46.35 22.23,45.72 C10.1 20.48,45.78 20.48,47.78 | 20.48,47.78 C11.1 20.32,49.22 v20,49.53 | PU2.1 23.18,20.64 v22.23,19.68 | PU1.1 21.64,26.72 v21.59,26.67 | C3.1 42.01,26.89 C14.1 | 38.43,12.06 U$1.4
  Top 0.508: v38.42,10.48 38.43,10.49 38.43,12.06
  Top 0.61: IC_STATUS.16 59.05,18.63 C24.1 | C24.1 58.95,16.73 C25.1 | C24.1 58.74,18.95 v58.74,20.32 | IC1.16 20.85,40.84 C16.1 | C16.1 20.22,41.28 C15.1 v18.1,40.01 | C16.1 20.42,41.27 21.27,41.27 21.64,41.65 v21.64,43.87 | v48.26,9.84 v48.26,5.71 | v6.99,49.85 10.48,49.85 v13.02,47.31 | v28.26,62.87 28.26,55.24 v27.94,54.93 | v83.19,27.3 v87.95,27.3
  Top 1.27: v25.08,1.91 v24.45,2.54 v23.81,3.17 23.55,3.44 U1.2 24.43,4.76 v25.4,4.76 26.04,4.76 v26.35,4.45
  Bottom 0.305: v44.4,36.2 45.19,36.2 C12.1
  Bottom 0.406: v38.42,10.48 38.42,8.99 C18.1 | v38.1,52.7 R26.2 R27.2 v35.56,52.7 | C12.1 45.51,34.51 C13.1
  Bottom 0.508: C17.1 38.42,8.99
  pour Route15: 0,66.36 91.12,66.36 91.12,-0.64 0,-0.64
FLASH_/HOLD
  Top 0.254: U2.20 37.97,38.29 37.78,38.1 35.88,38.1 34.92,39.05 30.48,39.05 29.21,40.32 29.21,42.86 27.94,44.13 24.77,44.13 24.13,44.77 MEM1.7
FLASH_/WP  (via drill 0.35)
  Top 0.254: v28.89,38.41 27.29,40.01 26.04,40.01 25.4,40.64 MEM1.3
  Top 0.305: U2.19 38.48,42.55 v38.53,42.55
  Bottom 0.254: 30.11,39.64 v28.89,38.41
  Bottom 0.305: 30.11,39.64 30.11,40.29 31.74,41.91 37.9,41.91 v38.53,42.55
GND  (via drill 0.35)
  Top 0.152: U2.23 36.47,40.32 36.49,40.32
  Top 0.305: CR1.4 CR1.5 | Q2.2 47.37,35.63 47.37,37 C2.2 | Q2.4 45.66,31.92 C1.2 | 33.66,32.99 34.51,32.99 U2.35 36.16,32.98 v36.83,33.66 | U2.47 41,29.88 | U2.8 40.84,36.01 v40.77,35.93 | IC_STATUS.13 v65.09,16.83 | LED14.C v54.29,46.67 | POW.C 14.61,2.22 v13.65,3.17
  Top 0.406: v36.2,42.86 36.09,42.76 C8.2 36.49,41.2 36.49,40.32 | v30.92,39.95 30.8,40.08 C9.2 v30.8,43.18 | C19.2 32.78,32.99 33.66,32.99 | v34.29,27.62 C20.2 31.75,26.67 v31.75,26.04 | C10.2 18.84,47.52 C11.2 18.42,49.22 v18.73,49.53 | MEM1.4 26.67,41.34 v27.18,40.83 | C30.2 7.72,46.04 v6.03,46.04 | C28.2 6.57,33.76 v6.03,34.29 | C29.2 11.01,38.84 v11.43,38.42 | CR1.4 13.98,22.21 CN1.GND | CR1.5 20.54,22.33 v20.95,21.91 | PD2.2 27.2,21.69 v27.3,21.59 | PD1.2 27.25,26.72 v27.3,26.67 | C3.2 43.81,26.99 43.81,28.79 C14.2 43.5,29.11 v43.5,30.48 | 41,29.88 v40.64,29.53 | v46.04,30.48 45.82,30.7 C1.2 | Q2.2 47.62,35.32 48.59,34.35 v48.9,33.02 | v48.9,37.15 48.74,37 47.37,37 | 57.15,18.63 C24.2 | v70.17,14.29 IC_STATUS.8 70.9,12.48 v71.75,13.34 | IC1.1 14.71,40.11 v14.92,40.32
  Top 0.508: U$1.6 40.63,10.79 v40.32,10.48
  Top 0.61: C25.2 57.15,16.83 57.15,18.63 | C24.2 57.25,20.11 v57.47,20.32 | C16.2 18.2,43.08 C15.2 18.1,43.81 v18.73,44.45 18.84,44.55 C10.2 | v24.77,56.52 24.13,57.15 Q3.2 24.13,59.37 v24.77,60.01 | v42.23,57.15 40.81,57.15 Q4.2 41.59,57.32 42.23,57.96 v42.23,58.42 | v66.04,55.56 Q5.2 66.67,57.96 v66.67,60.64 | v83.5,56.52 83.33,56.69 Q6.2 81.92,55.56 82.23,55.24 v83.5,55.24 | C21.2 v7.62,53.02 | Q7.2 v82.55,35.56 | C23.2 48.67,57.15 v48.88,56.94 | IC1.8 v12.7,30.16 | v22.86,37.78 IC1.15 IC1.14 | IC1.12 v22.86,33.97 | IC1.10 v22.86,31.43 | C7.2 v11.43,4.76
  Top 1.27: Q1.1 15.29,11.48 v15.56,11.75 16.19,12.38 | 16.19,12.38 C6.2 | U1.3 21.47,12.06 v25.08,12.06 v26.04,12.06 v26.99,12.06 | U1.3 v21.27,16.19 v21.27,17.14 | U1.3 v21.27,8.57 v21.27,7.62 | U1.3 16.31,12.26 16.19,12.38
  Bottom 0.305: v40.01,36.51 40.01,36.21 C4.2 39.05,34.59 v39.05,32.7
  Bottom 0.406: v48.9,33.02 C13.2 47.2,34.71 C12.2 48.26,36.51 v48.9,37.15
  Bottom 0.508: v40.32,10.48 40.22,10.38 C18.2 40.22,6.45 C17.2
  Bottom 0.61: LCD.1 30.16,46.67 C22.2
  other vias: 26.04,45.09 25.72,37.47 12.38,22.23 16.19,13.02 17.4,12.29 38.42,20.95 43.18,45.72 43.18,53.34 54.29,3.81 73.98,3.81 62.55,22.23 67.31,20.95 39.69,23.5 56.2,33.02 30.48,24.13 30.48,21.59 33.02,21.59 33.02,24.13 30.48,19.05 33.02,19.05 12.7,19.05 15.24,19.05 17.78,19.05 20.32,19.05 12.7,27.94 15.24,27.94 17.78,27.94 27.94,17.78 27.94,15.24 27.94,10.16 27.94,5.08 33.02,10.16 33.02,5.08 43.18,19.05 43.18,21.59 46.99,16.51 49.53,16.51 49.53,13.97 46.99,13.97 50.8,27.94 49.21,27.94 52.07,30.48 51.12,38.1 51.12,34.29 53.34,53.34 53.34,50.8 66.04,54.29 67.31,54.29 25.4,53.34 6.35,52.07 6.35,54.61 6.35,48.26 6.35,44.45
  pour Route2: -0.64,65.41 93.03,65.41 93.03,-1.91 -0.64,-1.91
  pour Bottom: -1.91,67.31 94.93,67.31 94.93,-1.27 -1.91,-1.27
  pour Top: -0.95,66.67 94.93,66.67 94.93,-3.17 -0.95,-3.17
HSE_OUT
  Top 0.152: Q2.3 45.33,34.99 U2.6
  Top 0.305: Q2.3 45.82,35.48 C2.1
N$1
  Top 0.406: R9.2 ROT_ENC.2
N$2  (via drill 0.35)
  Top 0.61: LED1.A v26.67,62.23
  Bottom 0.61: v26.67,62.23 R20.1
N$3
  Top 0.305: CN1.D- 10.64,24.61 10.9,24.87 CR1.2
N$4
  Top 0.61: LED2.A R21.1
N$5  (via drill 0.35)
  Top 0.61: LED3.A v68.26,62.23
  Bottom 0.61: v68.26,62.23 67.94,61.91 R22.1
N$6
  Top 0.61: LED5.A R24.1
N$7
  Top 0.61: R10.1 13.65,58.73 IF_1.ANODE
N$8
  Bottom 0.61: R11.1 IF_2.ANODE
N$9
  Top 0.61: R12.1 55.24,59.05 IF_3.ANODE
N$10
  Bottom 0.61: R13.1 71.28,59.05 73.19,60.96 IF_4.ANODE
N$11
  Bottom 0.61: R14.1 87.31,45.4 IF_5.ANODE
N$12
  Top 0.61: IF_1.CATHODE 22.54,60.64 | 22.54,60.64 23.01,60.64 Q3.3 | 22.54,60.64 22.45,60.74 LED1.C
N$13
  Top 0.61: LED2.C 37.37,60.64 | IF_2.CATHODE 37.37,60.64 | 37.37,60.64 38.49,59.52 Q4.3
N$14
  Top 0.61: IF_3.CATHODE 61.91,60.64 | 61.91,60.64 63.5,62.23 LED3.C | 61.91,60.64 63.03,59.52 Q5.3
N$15
  Top 0.61: IF_4.CATHODE 78.33,60.96 | 78.33,60.96 LED4.C | 78.33,60.96 78.33,60.1 79.55,58.88 Q6.3
N$16
  Top 0.61: IF_5.CATHODE 86.19,40.47 Q7.3 85.82,36.15 LED5.C
N$17
  Top 1.27: R_SHORT.1 9.26,11.48 Q1.2 ONOFF.2 C6.1
N$18
  Top 1.27: PWR.2 ONOFF.1
N$19
  Top 0.305: CN1.D+ 10.63,23.81 10.85,23.6 CR1.3
N$20
  Top 0.305: CR1.7 23.02,24.87 | 23.02,24.87 25.56,24.87 PD1.1 27.24,25.02 28.57,26.35 R2.2 | PU1.2 23.02,24.87
N$21
  Top 0.406: R25.2 ROT_ENC.3
N$22
  Top 0.61: R19.2 Q7.1
N$23
  Top 0.406: R28.2 ROT_ENC.4
N$24
  Top 0.305: CR1.6 23.18,23.6 | 23.18,23.6 25.51,23.6 PD2.1 27.52,23.39 30.48,26.35 R3.2 | PU2.2 23.18,23.6
N$25  (via drill 0.35)
  Top 0.61: LED4.A 81.69,61.18 v82.23,60.64
  Bottom 0.61: v82.23,60.64 80.64,59.05 R23.1
N$26
  Top 0.406: R9.1 7.83,35.56 C28.1 9.31,35.46 12.06,32.7 IC1.6
N$27
  Top 0.305: R25.1 C29.1
  Top 0.406: IC1.4 13.02,35.24 9.31,38.95 C29.1
N$28
  Top 0.305: 7.83,44.45 C30.1
  Top 0.406: 7.83,44.45 R28.1 11.11,42.55 12.7,40.96 12.7,38.1 13.02,37.78 IC1.2
N$29
  Top 0.305: LED6.A R4.1
N$30
  Top 0.305: IC_STATUS.15 62.55,16.51 56.2,10.16 R4.2
N$31
  Top 0.152: U2.5 46.48,34.48 46.67,34.29 46.67,34 Q2.1
  Top 0.305: C1.1 47.52,33.15 Q2.1
N$32
  Top 0.305: LED7.A R5.1
N$33
  Top 0.305: IC_STATUS.1 60.11,12.48 58.42,10.79 R5.2
N$34
  Top 0.305: LED8.A R6.1
N$35
  Top 0.305: IC_STATUS.2 62.55,11.11 62.23,10.79 61.28,10.79 60.64,10.16 R6.2
N$36
  Top 0.305: LED9.A R7.1
N$37
  Top 0.305: IC_STATUS.3 63.82,11.11 62.87,10.16 R7.2
N$38
  Top 0.305: R8.1 LED10.A
N$39
  Top 0.305: IC_STATUS.4 R8.2
N$40
  Top 0.305: R29.1 LED11.A
N$41
  Top 0.305: R29.2 67.31,9.84 66.36,10.79 IC_STATUS.5
N$42
  Top 0.305: R30.1 LED12.A
N$43
  Top 0.305: IC_STATUS.6 67.63,11.11 68.58,10.16 69.22,10.16 69.53,9.84 R30.2
N$44  (via drill 0.35)
  Top 0.305: U2.44 39.5,29.08 v40.32,28.26
  Bottom 0.305: v40.32,28.26 47.62,28.26 49.21,26.67 BOOT0SEL.2
N$45
  Top 0.61: R15.1 24.45,52.39 SV1.2
N$46
  Top 0.61: R15.2 22.23,56.51 Q3.1
N$47
  Top 0.61: R16.2 38.74,55.88 Q4.1
N$48
  Top 0.305: LED13.A R31.1
N$49
  Top 0.61: R17.2 Q5.1
N$50
  Top 0.61: R17.1 63.18,51.76 TIM3.2
N$51
  Top 0.61: R18.2 Q6.1
N$52
  Top 0.305: R18.1 77.79,52.71 77.15,52.07 SV4.2
N$53
  Top 0.61: SV5.2 R19.1
N$54
  Top 0.305: IC_STATUS.7 68.9,11.11 69.22,10.79 70.8,10.79 71.75,9.84 R31.2
N$55
  Top 0.305: R1.1 LED14.A
N$56
  Top 0.305: POW.A R32.1
PB0  (via drill 0.35)
  Top 0.305: U2.18 38.99,41.85 39.37,42.23 39.37,45.72 43.81,50.16 v44.45,50.16 | v47.62,45.09 47.09,45.62 R1.2
  Bottom 0.305: v44.45,50.16 47.62,46.99 v47.62,45.09
POT1
  Top 0.305: U2.10 43.98,36.99 44.45,37.47 44.45,38.1 44.77,38.42 48.9,38.42 51.44,35.88 POT1.2
POT2
  Top 0.305: POT2.2 46.35,41.91 42.95,38.51 U2.12
ROT_BUTT
  Top 0.254: IC1.3 17.46,36.51 19.05,34.92 19.05,29.84 19.68,29.21 22.23,29.21 25.4,32.38 25.4,33.97 27.43,36.01 U2.29
ROT_CLK
  Top 0.254: IC1.5 17.46,33.97 18.41,33.02 18.41,29.83 19.67,28.57 22.54,28.57 26.04,32.07 26.04,33.66 27.88,35.5 U2.30
ROT_DAT
  Top 0.254: IC1.7 17.46,31.43 17.78,31.11 17.78,29.53 19.37,27.94 22.86,27.94 26.67,31.75 26.67,33.34 28.32,34.99 U2.31
RST  (via drill 0.35)
  Top 0.305: S1.3 S1.4 55.92,45.12 53.34,42.55 | 53.34,42.55 v49.85,39.05 | v41.27,34.92 41.85,35.5 U2.7 | JP1.10 59.69,36.2 53.34,42.55
  Bottom 0.305: v49.85,39.05 45.4,39.05 v41.27,34.92 C4.1
SCL
  Top 0.305: U2.21 37.49,40.34 37.6,40.45 37.6,40.46 37.78,40.64 37.78,43.5 38.1,43.81 LCD.4
  Bottom 0.406: LCD.4 R26.1
SD_CS
  Top 0.305: U2.38 36.47,29.17 35.88,28.57 35.88,13.34 36.23,12.98 U$1.2
SDA
  Top 0.305: U2.22 36.98,40.1 36.99,40.11 36.99,40.49 37.15,40.64 37.15,43.5 36.51,44.13 35.88,44.13 35.56,44.45 LCD.3
  Bottom 0.406: R27.1 LCD.3
SPI1_MISO
  Top 0.305: U2.40 37.49,24.11 41.73,19.86 U$1.7
SPI1_MOSI  (via drill 0.35)
  Top 0.305: U$1.3 37.33,21.46 v37.47,21.59 | U2.41 37.97,25.21 v38.73,24.45
  Bottom 0.305: v37.47,21.59 38.73,22.86 v38.73,24.45
SPI1_SCK
  Top 0.305: U2.39 36.98,23.66 39.53,21.11 U$1.5
SPI2_MISO
  Top 0.254: U2.27 27.77,36.99 24.13,40.64 MEM1.2
SPI2_MOSI  (via drill 0.35)
  Top 0.254: U2.28 27.01,36.49 v26.67,36.83
  Top 0.305: v26.67,46.04 MEM1.5
  Bottom 0.254: v26.67,36.83 26.67,37.47 28.26,39.05 28.26,44.45 v26.67,46.04
SPI2_SCK  (via drill 0.35)
  Top 0.254: U2.26 28.54,37.5 v26.99,39.05
  Top 0.305: v25.4,46.04 MEM1.6
  Bottom 0.254: 26.35,39.05 24.77,40.64 24.77,45.4 v25.4,46.04
  Bottom 0.305: v26.99,39.05 26.35,39.05
SPI2_SS
  Top 0.254: MEM1.1 22.86,43.18 23.18,43.5 27.3,43.5 28.57,42.23 28.57,40.01 30.59,37.99 U2.25
SWCLK  (via drill 0.35)
  Top 0.305: U2.37 35.99,29.96 35.56,29.53 35.24,29.53 v34.61,28.89 | v47.31,26.99 58.42,26.99 60.01,28.57 JP1.4
  Bottom 0.305: v34.61,28.89 35.24,28.26 35.24,27.62 37.15,25.72 40.32,25.72 41.91,24.13 46.04,24.13 47.31,25.4 v47.31,26.99
SWDIO  (via drill 0.35)
  Top 0.305: U2.34 35.71,33.49 35.88,33.66 35.88,34.29 v36.2,34.61 | JP1.2 46.35,26.04 v45.72,25.4
  Bottom 0.305: v45.72,25.4 44.13,26.99 36.83,26.99 35.88,27.94 35.88,34.29 v36.2,34.61
TIM2_CH1  (via drill 0.35)
  Top 0.305: U2.15 40.49,38.27 39.37,37.15 v38.73,37.15
  Bottom 0.305: v38.73,37.15 39.05,37.47 39.05,39.05 40.01,40.01 40.01,43.18 39.37,43.81 31.43,43.81 31.11,44.13 30.43,44.13 26.99,47.58 SV1.3
TIM2_CH2  (via drill 0.35)
  Top 0.305: U2.11 41.31,37.5 v40.96,37.15 | v40.01,48.26 39.05,49.21 22.54,49.21 21.91,49.85 SV1.1
  Bottom 0.305: v40.96,37.15 40.96,43.81 40.01,44.77 v40.01,48.26
TIM3_CH1
  Top 0.305: U2.16 39.98,40.62 40.64,41.27 40.64,45.09 43.5,47.94 58.42,47.94 59.69,46.67 65.41,46.67 65.72,46.99 TIM3.3
TIM3_CH2
  Top 0.305: U2.17 39.5,41.08 40.01,41.59 40.01,45.4 43.81,49.21 TIM3.1
TIM4_CH1  (via drill 0.35)
  Top 0.305: U2.42 38.48,26.29 41.27,23.5 v77.79,23.5
  Bottom 0.305: v77.79,23.5 77.79,44.45 74.61,47.62 SV4.1
TIM4_CH2  (via drill 0.35)
  Top 0.305: U2.43 38.99,28.32 40.64,26.67 40.64,25.72 41.91,24.45 74.61,24.45 v79.69,29.53
  Bottom 0.305: v79.69,29.53 SV4.3
TIM9_CH2  (via drill 0.35)
  Top 0.305: R16.1 41.91,52.7 42.23,52.39 v42.23,50.8 | v41.59,44.45 41.48,44.34 U2.13
  Bottom 0.305: v42.23,50.8 42.23,45.09 v41.59,44.45
TIM10_CH1  (via drill 0.35)
  Top 0.305: U2.45 39.98,33.63 v40.01,33.66 | v55.88,31.43 56.83,32.38 67.31,32.38 71.12,36.2 71.12,38.1 73.03,40.01 SV5.1
  Bottom 0.305: v40.01,33.66 40.64,33.66 40.96,33.97 41.59,33.97 44.13,31.43 v55.88,31.43
TIM11_CH1
  Top 0.305: U2.46 40.49,32.23 40.64,32.38 41.59,32.38 42.55,31.43 44.13,31.43 44.77,30.8 44.77,30.16 45.24,29.69 60.48,29.69 60.64,29.84 72.39,29.84 75.56,33.02 SV5.3
USBD+
  Top 0.305: R3.1 30.48,33.34 31.14,34 U2.33
USBD-
  Top 0.305: R2.1 28.57,33.66 29.4,34.48 U2.32
VDD  (via drill 0.35)
  Top 0.152: v11.11,9.53 | v14.92,6.35
  Top 0.305: CR1.1 14.29,26.14 CR1.8
  Top 0.61: 11.43,26.14 10.58,26.14 9.86,25.41 CN1.VBUS 9.46,25.41 10.16,26.11 10.16,26.35 v9.84,26.67 | 11.43,26.14 14.29,26.14 | C21.1 R10.2 v13.33,56.84 v13.34,56.83 | R21.2 v46.03,60.01 | v46.03,60.01 v46.04,60.01 | R12.2 49.85,59.05 v48.9,60.01 | C23.1 45.41,59.38 | 45.41,59.38 v46.03,60.01 | 45.41,59.38 44.78,60.01 v44.45,60.01 | R24.2 79.38,31.75 80.33,30.8 v85.41,30.8 | 11.43,26.14 11.43,28.26 9.84,29.84 v9.84,30.16
  Top 1.27: U1.1 18.11,4.76 v17.46,4.76 v16.51,4.76 C7.1 v14.92,6.35 14.92,7.26 Q1.3 12.65,9.53 v11.11,9.53 R_SHORT.2
  Route15 0.61: v26.04,55.24 26.04,58.42 | 28.89,58.74 29.21,58.42 v29.21,56.2
  Route15 1.905: v17.46,4.76 15.88,4.76 v11.11,9.53 6.99,13.65 6.99,18.1 9.84,20.95 v9.84,26.67 v9.84,30.16 9.84,35.24 8.89,36.2 8.89,47.31 13.34,51.75 v13.34,56.83 13.34,57.78 14.29,58.74 18.1,58.74 18.41,58.42 26.04,58.42 26.35,58.74 28.89,58.74 v35.88,58.74 39.69,58.74 40.96,60.01 v44.45,60.01 v46.04,60.01 v48.9,60.01 52.07,60.01 53.34,58.74 66.67,58.74 v69.69,55.72 v70.64,54.77 72.71,52.7 v75.88,52.7 82.87,52.7 85.41,50.16 v85.41,47.62 v85.41,30.8 85.41,16.19 76.83,7.62 24.77,7.62 21.91,4.76 v17.46,4.76
  Bottom 0.61: v26.04,55.24 26.04,58.1 R20.2 R11.2 29.21,58.42 v29.21,56.2 32.06,53.34 C22.1 | C22.1 33.02,48.89 LCD.2 | C22.1 32.38,50.16 33.02,50.16 33.66,50.8 33.66,52.4 35.8,54.54 35.8,58.66 v35.88,58.74 | R13.2 R22.2 68.26,57.15 v69.69,55.72 70.8,56.83 R13.2 | R13.2 70.64,56.99 v70.64,54.77 | R23.2 76.84,57.14 77.08,56.9 77.08,53.9 v75.88,52.7 | R14.2 84.78,46.99 v85.41,47.62

### Text on the board
tPlace: GND | Vdd | SDA | SCL | CH2 | CH1 | 3v3 | BUT | Reset | TIM10 | CLK | DAT | RST | GND | TIM11 | GND | GND | 74HCS365 | SWCLK | GND | SWDIO | 3V3 | Low | High | 4.5-6V | 74HC595 | + | - | tinyurl.com/jwbportfolio | STM32L151 Interrupter / Will Buchta / 7/2022
tDocu: 10 mil traces to reduce cross talk / edge times no faster than 5ns, so / should be good